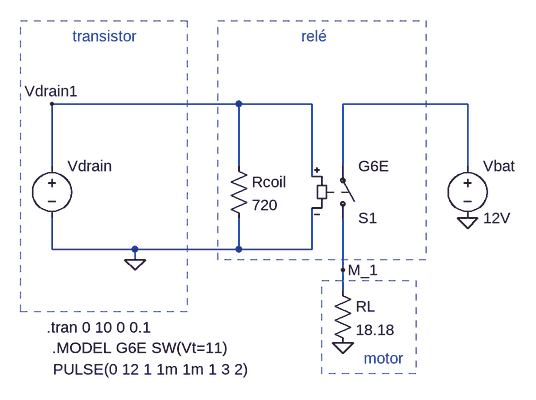
[diagram p0: schematic sim_driver_motor.asc]
sim_driver_motor.asc, the LTspice schematic file:
Version 4
SHEET 1 880 680
WIRE 368 32 80 32
WIRE 480 32 368 32
WIRE 720 32 528 32
WIRE 80 128 80 32
WIRE 368 128 368 32
WIRE 528 128 528 32
WIRE 720 128 720 32
WIRE 480 144 480 32
WIRE 80 256 80 208
WIRE 208 256 80 256
WIRE 368 256 368 208
WIRE 368 256 208 256
WIRE 480 256 480 192
WIRE 480 256 368 256
WIRE 208 272 208 256
WIRE 528 288 528 208
WIRE 528 320 528 288
FLAG 720 208 0
FLAG 528 400 0
FLAG 208 272 0
FLAG 80 32 Vdrain1
FLAG 528 288 M_1
SYMBOL voltage 80 112 R0
WINDOW 3 2 329 Left 2
WINDOW 123 0 0 Left 0
WINDOW 39 0 0 Left 0
SYMATTR InstName Vdrain
SYMATTR Value PULSE(0 12 1 1m 1m 1 3 2)
SYMBOL voltage 720 112 R0
WINDOW 123 0 0 Left 0
WINDOW 39 0 0 Left 0
SYMATTR InstName Vbat
SYMATTR Value 12V
SYMBOL res 352 112 R0
SYMATTR InstName Rcoil
SYMATTR Value 720
SYMBOL res 512 304 R0
SYMATTR InstName RL
SYMATTR Value 18.18
SYMBOL sw 528 224 M180
SYMATTR InstName S1
SYMATTR Value G6E
TEXT 112 -72 Left 2 ;transistor
TEXT 464 -72 Left 2 ;relé
TEXT 560 424 Left 2 ;motor
TEXT 72 376 Left 2 !.tran 0 10 0 0.1
TEXT 80 408 Left 2 !.MODEL G6E SW(Vt=11)
RECTANGLE Normal 288 352 32 -96 2
RECTANGLE Normal 656 272 336 -96 2
RECTANGLE Normal 640 448 496 304 2

The netlist it stands for:
* sim_driver_motor.asc
Vdrain Vdrain1 0 PULSE(0 12 1 1m 1m 1 3 2)
Vbat N001 0 12V
Rcoil Vdrain1 0 720
RL M_1 0 18.18
S1 M_1 N001 Vdrain1 0 G6E
* transistor
* relé
* motor
.tran 0 10 0 0.1
.MODEL G6E SW(Vt=11)
.backanno
.end